# Altium schematic sheet АЧАД.642319.ххх_Э3.SchDoc: Наименование
size 209 x 297 mm; ApprovedBy: Утвердил; CheckedBy: Проверил; Author: Разработал; CompanyName: ТОВ "Радіонікс"; DrawnBy: Н.Контр; Engineer: Т.Контр; SheetNumber: 1; SheetTotal: 1; PageSetup: Record=PageOptions|CenterHorizontal=True|CenterVertical=True|PrintScale=0.94|XCorrection=1.00|YCorrection=1.00|PrintKind=1|BorderSize=5000000|LeftOffset=0|BottomOffset=0|Orientation=1|PaperLength=1000|PaperWidth=1000|Scale=100|PaperSource=7|PrintQuality=-4|MediaType=1|DitherType=10|PaperKind=A4|PrintScaleMode=1; DecimalNumber: АЧАД.642319.ххх Э3; HeadOfSector: Нач. сектора; MainDevice: Перв.примен.; Name: Блок переключателів; DecimalNumber_MIRROR: ххх.913246.ДАЧА; DocumentName: Sheet1.SCHDOC
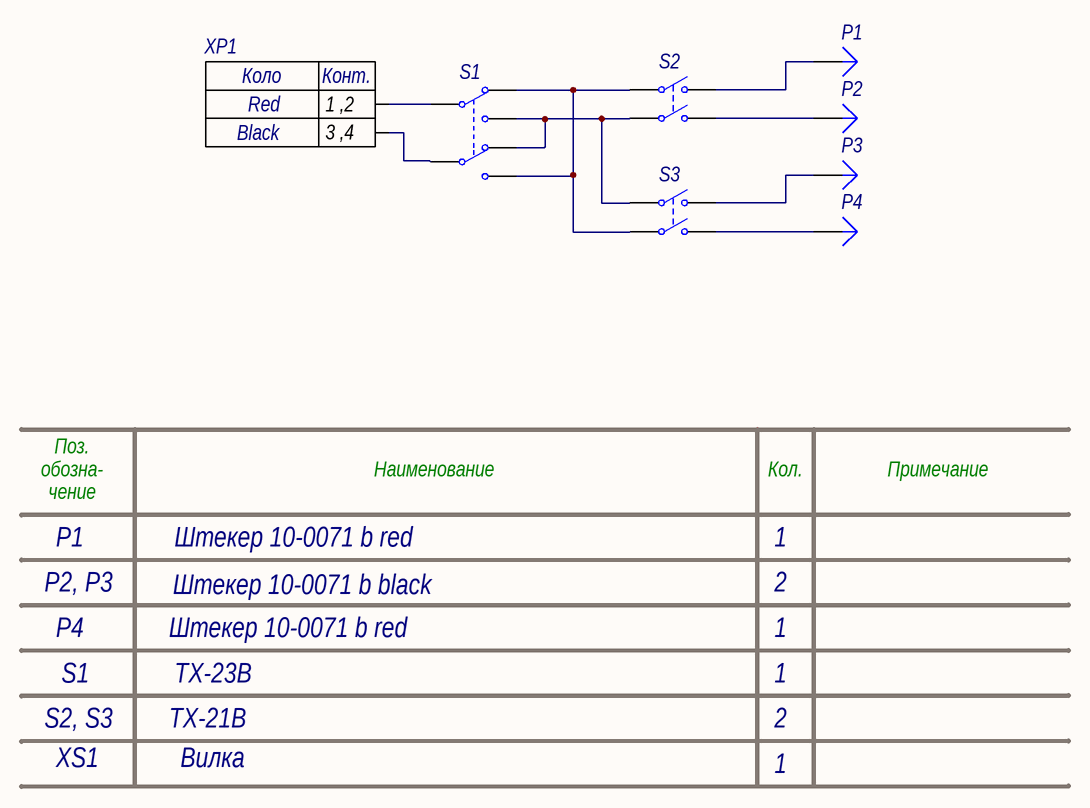
[diagram p0: АЧАД.642319.ххх_Э3.SchDoc]

## Parts
P1  Plug  [PIN1]  (value not drawn)
P2  Plug  [PIN1]  (value not drawn)
P3  Plug  [PIN1]  (value not drawn)
P4  Plug  [PIN1]  (value not drawn)
S1  SW DPDT  [SOT23-6_N]  (value not drawn)
S2  SW-DPST  [DPST-4]  (value not drawn)
S3  SW-DPST  [DPST-4]  (value not drawn)
XP1  M20-9770242  (value not drawn)

## Nets
NetP1_1: P1.1 S2.2(NO1)
NetP2_1: P2.1 S2.4(NO2)
NetP3_1: P3.1 S3.2(NO1)
NetP4_1: P4.1 S3.4(NO2)
NetS1_1: S1.1(COMMON1) XP1.1(1_,2)
NetS1_2: S1.2(NC1) S1.6(NO2) S2.1(COMMON1) S3.3(COMMON2)
NetS1_3: S1.3(NO1) S1.4(NC2) S2.3(COMMON2) S3.1(COMMON1)
NetS1_5: S1.5(COMMON2) XP1.2(3_,4)

## Notes on the sheet
- Black
- Red
- Поз.
- обозна-
- чение
- Наименование
- Кол.
- Примечание
- P1
- Штекер 10-0071 b red
- 1
- P2, P3
- P4
- Штекер 10-0071 b black
- 2
- S2, S3
- S1
- TX-21B
- TX-23B
- XS1
- Вилка
- Перв.примен.
- Справ.№
- Подп. и дата
- Инв.№ дубл.
- Взам.инв.№
- Подп.и дата
- Разраб.
- Изм.
- Лист
- № докум.
- Подп.
- Дата
- Лит.
- Масштаб
- Масса
- Т.контр.
- Пров.
- СХЕМА   ЕЛЕКТРИЧНА
- ПРИНЦИПОВА
- Листов
- Инв.№ подл.
- Утв.
- Н.контр.
- Нач.сект.
- Копировал
- Формат  A4
- (in symbol M20-9770242) Коло; Конт.

## Library data of the parts
S1 = SW DPDT: Switch; Published: 24-Mar-1999; LatestRevisionDate: 29-May-2009; LatestRevisionNote: IPC-7351 Footprint Added.; PackageVersion: Mar-2001; PackageReference: SOT23-6; Publisher: Altium Limited; PackageDescription: 6-Pin SOT-23 Package 0.95 mm Pitch, 2.7 mm Lead Span; Code_JEITA: SC-74; Code_IPC: SOT26A-6
S2 S3 = SW-DPST: Double-Pole, Single-Throw Switch; Published: 24-Mar-1999; LatestRevisionDate: 17-Jul-2002; LatestRevisionNote: Re-released for DXP Platform.; PackageReference: DPST-4; Publisher: Altium Limited; PackageDescription: Switch; 4 Leads
P1-P4 = Plug: LatestRevisionDate: 17-Jul-2002; LatestRevisionNote: Re-released for DXP Platform.; Publisher: Altium Limited